# Altium schematic sheet ETS_v8-nordic-split.SchDoc: nRF52811-CAAA Reference Layout (2-Layers)
size A4; Revision: 1.0; SheetNumber: 1; SheetTotal: 1; DrawnBy: RUBR; DocumentSize: A4; PCAName: nRF52811-CAAA Reference Layout (2-Layers)
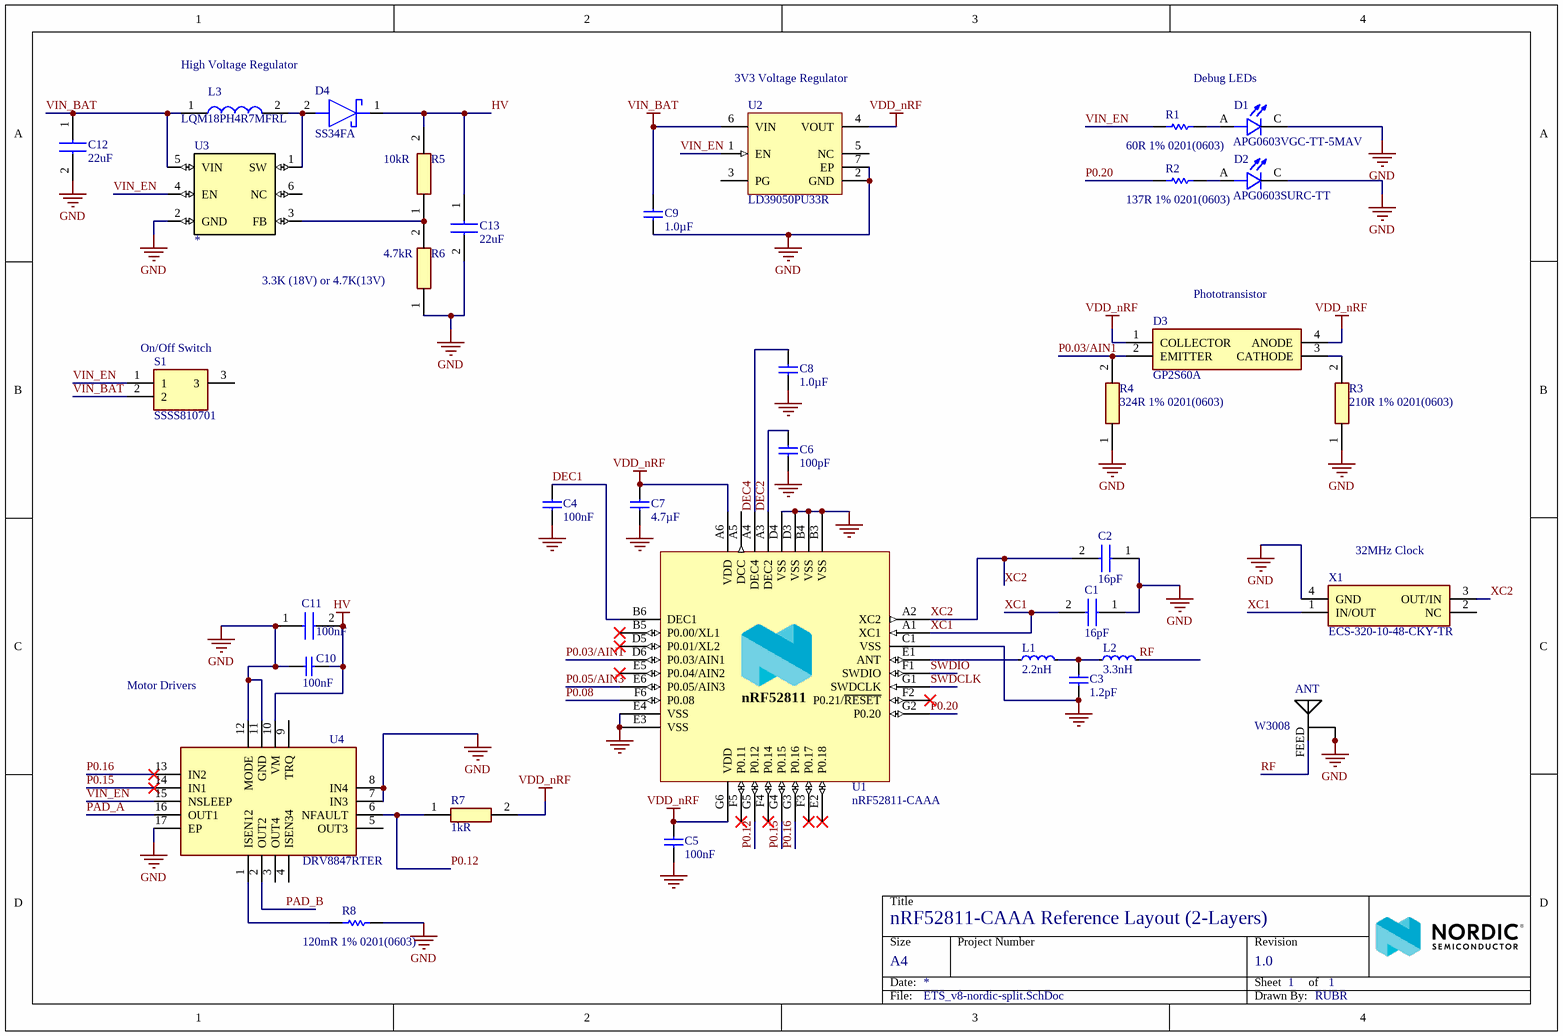
[diagram p0: ETS_v8-nordic-split.SchDoc]

## Parts
ANT  W3008  [*ANTENNA_W3008W3008(Primary)]
C1  16pF  [CAPC0603X33N]
C2  16pF  [CAPC0603X33N]
C3  1.2pF  [CAPC0603X03L_C]
C4  100nF  [CAPC0603X03L_C]
C5  100nF  [CAPC0603X03L_C]
C6  100pF  [CAPC0603X03L_C]
C7  4.7µF  [CAPC1608X06L]
C8  1.0µF  [CAPC1005X04L]
C9  1.0µF  [CAPC1005X04L]
C10  100nF  [CAPC0603X03L_C]
C11  100nF  [CAPC0603X03L_C]
C12  22uF  [CAPC2012X145N]
C13  22uF  [CAPC2012X145N]
D1  APG0603VGC-TT-5MAV  [LED_APG0603SEC-E-TT]
D2  APG0603SURC-TT  [LED_APG0603SEC-E-TT]
D3  GP2S60A  [GP2S60B]
D4  SS34FA  [SODFL3618X143N]
L1  2.2nH  [INDC0603X03L_C]
L2  3.3nH  [INDC0603X03L_C]
L3  LQM18PH4R7MFRL  [LQW18CA32NJ00D]
R1  60R 1% 0201(0603)  [RESC0201(0603)_L]
R2  137R 1% 0201(0603)  [RESC0201(0603)_L]
R3  210R 1% 0201(0603)  [RESC0603X26N]
R4  324R 1% 0201(0603)  [RESC0603X26N]
R5  10kR  [RESC0603X26N]
R6  4.7kR  [RESC0603X28N]
R7  1kR  [RESC0603X28N]
R8  120mR 1% 0201(0603)  [RESC0201(0603)_L]
S1  SSSS810701  [SSSS810701]
U1  nRF52811-CAAA  [BGA33C40P6X6_247X246X50]
U2  LD39050PU33R  [DFN6D_L]
U3  *  [*SOT23-6]
U4  DRV8847RTER  [QFN50P300X300X80-17N-D]
X1  ECS-320-10-48-CKY-TR  [ECS240848CKYTR]

## Nets
GND: ANT.G1(GND) ANT.G2(GND) C1.1 C2.1 C3.1 C4.2 C5.2 C6.1 C7.2 C8.1 C9.1 C10.2 C11.1 C12.2 C13.2 D1.C D2.C R3.1 R4.1 R6.1 R8.2 U1.B3(VSS) U1.B4(VSS) U1.C1(VSS) U1.D3(VSS) U1.D4(VSS) U1.E3(VSS) U1.E4(VSS) U2.2(GND) U2.7(EP) U3.2(GND) U4.7(IN3) U4.8(IN4) U4.11(GND) U4.12(MODE) U4.17(EP) X1.4(GND)
HV: C10.1 C11.2 C13.1 D4.1(K) R5.2 U4.10(VM)
VDD_nRF: C5.1 C7.1 D3.1(COLLECTOR) D3.4(ANODE) R7.2 U1.A6(VDD) U1.G6(VDD) U2.4(VOUT)
VIN_BAT: C9.2 C12.1 L3.1 S1.2 U2.6(VIN) U3.5(VIN)
DEC1: C4.1 U1.B6(DEC1)
DEC2: C6.2 U1.A3(DEC2)
DEC4: C8.2 U1.A4(DEC4)
P0.03/AIN1: D3.2(EMITTER) R4.2 U1.D6(P0.03/AIN1)
P0.05/AIN3: U1.E6(P0.05/AIN3)
P0.08: U1.F6(P0.08)
P0.12: R7.1 U1.G5(P0.12) U4.6(NFAULT)
P0.15: U1.G4(P0.15) U4.14(IN1)
P0.16: U1.G3(P0.16) U4.13(IN2)
P0.20: R2.1 U1.G2(P0.20)
PAD_A: U4.16(OUT1)
PAD_B: U4.2(OUT2)
RF: ANT.FEED L2.2
SWDCLK: U1.G1(SWDCLK)
SWDIO: U1.F1(SWDIO)
VIN_EN: R1.1 S1.1 U2.1(EN) U3.4(EN) U4.15(NSLEEP)
XC1: C1.2 U1.A1(XC1) X1.1(IN/OUT)
XC2: C2.2 U1.A2(XC2) X1.3(OUT/IN)
NetC3_2: C3.2 L1.2 L2.1
NetD1_A: D1.A R1.2
NetD2_A: D2.A R2.2
NetD3_3: D3.3(CATHODE) R3.2
NetD4_2: D4.2(A) L3.2 U3.1(SW)
NetL1_1: L1.1 U1.E1(ANT)
NetR5_1: R5.1 R6.2 U3.3(FB)
NetR8_1: R8.1 U4.1(ISEN12)

Not connected (* = marked no-connect by the designer): S1 3; U1 A5(DCC) B5(P0.00/XL1)* D5(P0.01/XL2)* E2(P0.18)* E5(P0.04/AIN2)* F2(P0.21/~{RESET})* F3(P0.17)* F4(P0.14)* F5(P0.11)*; U2 3(PG) 5(NC); U3 6(NC); U4 3(OUT4) 4(ISEN34) 5(OUT3) 9(TRQ); X1 2(NC)

## Notes on the sheet
- High Voltage Regulator
- (near U2) 3V3 Voltage Regulator
- Debug LEDs
- (near R6) 3.3K (18V) or 4.7K(13V)
- (near D3) Phototransistor
- (near S1) On/Off Switch
- (near X1) 32MHz Clock
- Motor Drivers
- Title
- Size
- Date:
- A4
- Project Number
- Sheet         of
- Revision
- File:
- Drawn By:
- (in symbol nRF52811-CAAAA0) nRF52811

## Library data of the parts
ANT = W3008: 2.4GHz Bluetooth Chip RF Antenna 2.4GHz ~ 2.483GHz 1.7dBi Solder Surface Mount; MF: PulseLarsen Antennas; MP: W3008; Availability: Unavailable; SnapEDA_Link: https://www.snapeda.com/parts/W3008/PulseLarsen%20Antennas/view-part/233875/?ref=snap; Price: None; Package: None; Value: *
C1 C2 = GRM0335C1H160JA01D: Capacitor; Manufacturer_Name: Murata Electronics; Datasheet Link: http://www.murata.com/~/media/webrenewal/support/library/catalog/products/capacitor/mlcc/c02e.pdf; Height: 0.33mm; Manufacturer_Part_Number: GRM0335C1H160JA01D
C3 = C0201-1.2p: Capacitor, NP0, ±5%; Part Number: C0201-1.2p; Manufacturer: *; Manufacturer Part Number: *; LatestRevisionDate: 2014-11-13; Pin Count: 2; Publisher: Nordic Semiconductor; Published: 2014-11-13; Value: 1.2pF; Footprint Doc: 0201
C4 C5 C10 = C0201-100n: Capacitor, X5R, ±10%; Part Number: C0201-100n; Manufacturer: *; Manufacturer Part Number: *; LatestRevisionDate: 2017-11-09; Pin Count: 2; Publisher: Nordic Semiconductor; Published: 2014-11-13; Value: 100nF; Footprint Doc: 0201
C6 = C0201-100p: Capacitor, NP0, ±2%; Part Number: C0201-100p; Manufacturer: *; Manufacturer Part Number: *; LatestRevisionDate: 2017-11-09; Pin Count: 2; Publisher: Nordic Semiconductor; Published: 2014-11-13; Value: 100pF; Footprint Doc: 0201
C7 = C0603-4µ7: Capacitor, X5R, ±10%; Part Number: C0603-4µ7; Manufacturer: *; Manufacturer Part Number: *; LatestRevisionDate: 2009-11-23; Pin Count: 2; Publisher: Nordic Semiconductor; Published: 2009-05-08; Value: 4.7µF; Footprint Doc: 0603
C8 C9 = C0402-1µ0: Capacitor, X5R, ±5%; Part Number: C0402-1µ0; Manufacturer: *; Manufacturer Part Number: *; LatestRevisionDate: 2016-08-22; Pin Count: 2; Publisher: Nordic Semiconductor; Published: 2009-05-08; Value: 1.0µF; Footprint Doc: 0402
C11 = GRM188R61C106KAALD: Capacitor; Manufacturer_Name: Murata Electronics; Datasheet Link: https://psearch.en.murata.com/capacitor/product/GRM188R61C106KAAL%23.html; Height: 0.9mm; Manufacturer_Part_Number: GRM188R61C106KAALD
C12 C13 = GRM21BR61E226ME44K: Capacitor; Manufacturer_Name: Murata Electronics; Datasheet Link: http://www.murata.com/~/media/webrenewal/support/library/catalog/products/capacitor/mlcc/c02e.pdf; Height: 1.45mm; Manufacturer_Part_Number: GRM21BR61E226ME44K
D1 = APG0603SEC-E-TT: Green 527nm LED Indication - Discrete 3V 2-SMD, 0201; MF: Kingbright; SnapEDA_Link: https://www.snapeda.com/parts/APG0603SEC-E-TT/Kingbright/view-part/2754377/?ref=snap; Price: None; MP: APG0603SEC-E-TT; Value: *; Availability: Unavailable; Package: 0201 Kingbright
D2 = APG0603SEC-E-TT: Red 631nm LED Indication - Discrete 1.92V 2-SMD, 0201; MF: Kingbright; SnapEDA_Link: https://www.snapeda.com/parts/APG0603SEC-E-TT/Kingbright/view-part/2754377/?ref=snap; Price: None; MP: APG0603SEC-E-TT; Value: *; Availability: Unavailable; Package: 0201 Kingbright
D3 = GP2S60B: LED; Manufacturer_Name: Sharp Microelectronics; Datasheet Link: https://componentsearchengine.com/Datasheets/1/GP2S60B.pdf; Height: 1.25mm; Mouser2 Part Number: 852-GP2S60B; Mouser2 Price/Stock: https://www.mouser.com/Search/Refine.aspx?Keyword=852-GP2S60B; Manufacturer_Part_Number: GP2S60B
D4 = SS34FA: Schottky Diode; Manufacturer_Name: ON Semiconductor; Datasheet Link: https://componentsearchengine.com/Datasheets/1/SS34FA.pdf; Height: 1.43mm; Mouser2 Part Number: 512-SS34FA; Mouser2 Price/Stock: https://www.mouser.com/Search/Refine.aspx?Keyword=512-SS34FA; Manufacturer_Part_Number: SS34FA
L1 = L0201-2n2: High frequency chip inductor ±5%; Part Number: L0201-2n2; Manufacturer: *; Manufacturer Part Number: *; LatestRevisionDate: 2013-04-10; Pin Count: 2; Publisher: Nordic Semiconductor; Published: 2013-04-10; Value: 2.2nH; Footprint Doc: 0201
L2 = L0201-3n3: High frequency chip inductor ±5%; Part Number: L0201-3n3; Manufacturer: *; Manufacturer Part Number: *; LatestRevisionDate: 2013-04-10; Pin Count: 2; Publisher: Nordic Semiconductor; Published: 2013-04-10; Value: 3.3nH; Footprint Doc: 0201
L3 = LQM18PH4R7MFRL: Inductor; Manufacturer_Name: Murata Electronics; Datasheet Link: https://psearch.en.murata.com/inductor/product/LQM18PH4R7MFR%23.html; Height: 0.95mm; Mouser2 Part Number: 81-LQM18PH4R7MFRL; Mouser2 Price/Stock: https://www.mouser.com/Search/Refine.aspx?Keyword=81-LQM18PH4R7MFRL; Manufacturer_Part_Number: LQM18PH4R7MFRL
R1 R2 R8 = CMP-1010-00171-1: 1R 0.05W 1% 0201 (0603 Metric)  SMD; Case-Metric: 0603; Value: 1.00 Ohm; Case-EIA: 0201; Power: 0.05 W; Tolerance: 1 %; Technology: SMT
R3 = RC0201FR-0710KL: Resistor; Manufacturer_Name: YAGEO (PHYCOMP); Datasheet Link: https://componentsearchengine.com/Datasheets/1/RC0201FR-0710KL.pdf; Height: 0.26mm; Mouser2 Part Number: 603-RC0201FR-0710KL; Mouser2 Price/Stock: https://www.mouser.com/Search/Refine.aspx?Keyword=603-RC0201FR-0710KL; Manufacturer_Part_Number: RC0201FR-0710KL
R4 = RC0201FR-07390RL: Resistor; Manufacturer_Name: YAGEO (PHYCOMP); Datasheet Link: http://www.yageo.com/documents/recent/PYu-RC0201_51_RoHS_L_8.pdf; Height: 0.26mm; Manufacturer_Part_Number: RC0201FR-07390RL
R5 = RC0201FR-07100KL: Resistor; Manufacturer_Name: YAGEO (PHYCOMP); Datasheet Link: http://www.yageo.com/documents/recent/PYu-RC0201_51_RoHS_L_8.pdf; Height: 0.26mm; Manufacturer_Part_Number: RC0201FR-07100KL
R6 = CRCW02014K70FKED: Resistor; Manufacturer_Name: Vishay; Datasheet Link: http://www.vishay.com/docs/20035/dcrcwe3.pdf; Height: 0.28mm; Manufacturer_Part_Number: CRCW02014K70FKED
R7 = CRCW02011K00FNED: Resistor; Manufacturer_Name: Vishay; Datasheet Link: http://www.vishay.com/docs/20035/dcrcwe3.pdf; Height: 0.28mm; Manufacturer_Part_Number: CRCW02011K00FNED
S1 = SSSS810701: Switch; Manufacturer_Name: ALPS; Datasheet Link: https://componentsearchengine.com/Datasheets/1/SSSS810701.pdf; Mouser2 Part Number: 688-SSSS810701; Mouser2 Price/Stock: https://www.mouser.com/Search/Refine.aspx?Keyword=688-SSSS810701; Manufacturer_Part_Number: SSSS810701
U1 = nRF52811-CAAAA0: Multi-protocol Bluetooth Low Energy, IEEE 802.15.4, ANT and 2.4GHz proprietary system-on-chip; Manufacturer: Nordic Semiconductor; Part Number: nRF52811-CAAAA0; Manufacturer Part Number: nRF52811-CAAAA0; LatestRevisionDate: 2019-01-30; Pin Count: 33; Publisher: Nordic Semiconductor; Published: 2019-01-30; Value: nRF52811-CAAA; Footprint Doc: WLCSP-33
U2 = CMP-0244-00288-1: 500 mA Low Quiescent Current Low Noise Voltage Regulator, 3.3V, 6-Pin VDFDPN, Tape and Reel; PackageReference: DFN6D; ComponentLink1Description: Manufacturer URL; ComponentLink1URL: http://www.st.com; PackageVersion: 2008; PackageDescription: 6-Pin Plastic, Dual LLP, 3 x 3 mm Body, 0.95 mm Pitch, Exposed Pad; ComponentLink2URL: http://www.st.com/internet/com/TECHNICAL_RESOURCES/TECHNICAL_LITERATURE/DATASHEET/CD00227527.pdf; DatasheetVersion: 1/03/2009; ComponentLink2Description: Datasheet
U3 = MT3608: High Efficiency 1.2MHz / 2A Step Up Converter; SnapEDA_Link: https://www.snapeda.com/parts/MT3608/Aerosemi%20Technology%20Co.%2C%20Ltd/view-part/3218014/?ref=snap; Value: *
U4 = DRV8847RTER: Integrated Circuit; Manufacturer_Name: Texas Instruments; Datasheet Link: http://www.ti.com/lit/gpn/DRV8847; Height: 0.8mm; Mouser2 Part Number: 595-DRV8847RTER; Mouser2 Price/Stock: https://www.mouser.com/Search/Refine.aspx?Keyword=595-DRV8847RTER; Manufacturer_Part_Number: DRV8847RTER
X1 = ECS-320-10-48-CKY-TR: Crystal or Oscillator; Manufacturer_Name: ECS; Datasheet Link: https://www.ecsxtal.com/store/pdf/ECX-1048.pdf; Height: 0mm; Manufacturer_Part_Number: ECS-320-10-48-CKY-TR